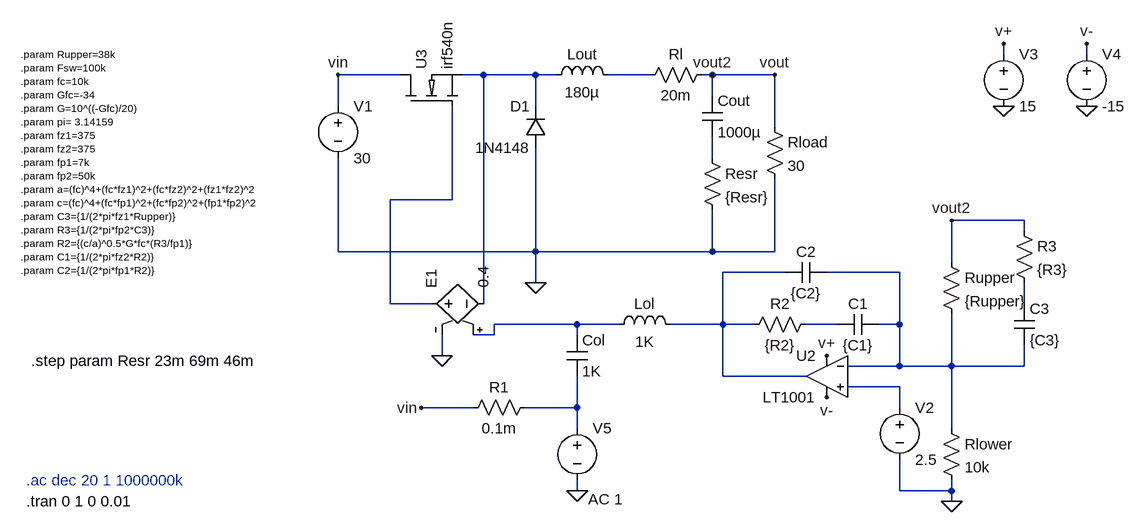
[diagram p0: schematic C P BASSO SMPS(BUCK) SIMULATION.asc]
C P BASSO SMPS(BUCK) SIMULATION.asc, the LTspice schematic file:
Version 4
SHEET 1 1188 756
WIRE 992 -48 992 -64
WIRE 1120 -48 1120 -64
WIRE 64 -16 -32 -16
WIRE 192 -16 160 -16
WIRE 272 -16 192 -16
WIRE 304 -16 272 -16
WIRE 448 -16 384 -16
WIRE 544 -16 528 -16
WIRE 640 -16 544 -16
WIRE 544 16 544 -16
WIRE -32 32 -32 -16
WIRE 272 32 272 -16
WIRE 640 64 640 -16
WIRE 544 112 544 80
WIRE 144 176 144 32
WIRE 144 176 48 176
WIRE 1024 208 912 208
WIRE 1024 224 1024 208
WIRE -32 256 -32 112
WIRE 272 256 272 96
WIRE 272 256 -32 256
WIRE 544 256 544 192
WIRE 544 256 272 256
WIRE 640 256 640 144
WIRE 640 256 544 256
WIRE 912 272 912 208
WIRE 656 288 560 288
WIRE 832 288 720 288
WIRE 272 304 272 256
WIRE 48 336 48 176
WIRE 112 336 48 336
WIRE 192 336 192 -16
WIRE 1024 336 1024 304
WIRE 336 368 208 368
WIRE 400 368 336 368
WIRE 560 368 560 288
WIRE 560 368 480 368
WIRE 608 368 560 368
WIRE 736 368 688 368
WIRE 832 368 832 288
WIRE 832 368 800 368
WIRE 208 384 208 368
WIRE 208 384 176 384
WIRE 336 384 336 368
WIRE 128 416 128 384
WIRE 832 432 832 368
WIRE 832 432 752 432
WIRE 912 432 912 352
WIRE 912 432 832 432
WIRE 1024 432 1024 400
WIRE 1024 432 912 432
WIRE 560 448 560 368
WIRE 688 448 560 448
WIRE 832 464 752 464
WIRE 176 496 96 496
WIRE 336 496 336 448
WIRE 336 496 256 496
WIRE 832 496 832 464
WIRE 336 528 336 496
WIRE 912 528 912 432
WIRE 336 624 336 608
WIRE 832 624 832 576
WIRE 912 624 912 608
WIRE 912 624 832 624
WIRE 912 640 912 624
FLAG 640 -16 vout
FLAG 912 208 vout2
FLAG 992 32 0
FLAG 1120 32 0
FLAG 992 -64 v+
FLAG 1120 -64 v-
FLAG 720 416 v+
FLAG 720 480 v-
FLAG 544 -16 vout2
FLAG -32 -16 vin
FLAG 336 624 0
FLAG 272 304 0
FLAG 912 640 0
FLAG 96 496 vin
FLAG 128 416 0
SYMBOL voltage -32 16 R0
WINDOW 123 0 0 Left 0
WINDOW 39 0 0 Left 0
SYMATTR InstName V1
SYMATTR Value 30
SYMBOL ind 288 0 R270
WINDOW 0 32 56 VTop 2
WINDOW 3 5 56 VBottom 2
SYMATTR InstName Lout
SYMATTR Value 180µ
SYMBOL res 544 -32 R90
WINDOW 0 0 56 VBottom 2
WINDOW 3 32 56 VTop 2
SYMATTR InstName Rl
SYMATTR Value 20m
SYMBOL cap 528 16 R0
SYMATTR InstName Cout
SYMATTR Value 1000µ
SYMBOL res 528 96 R0
SYMATTR InstName Resr
SYMATTR Value {Resr}
SYMBOL res 624 48 R0
SYMATTR InstName Rload
SYMATTR Value 30
SYMBOL OpAmps\\LT1001 720 384 M0
SYMATTR InstName U2
SYMBOL diode 288 96 R180
WINDOW 0 24 64 Left 2
WINDOW 3 24 0 Left 2
SYMATTR InstName D1
SYMATTR Value 1N4148
SYMBOL res 896 256 R0
SYMATTR InstName Rupper
SYMATTR Value {Rupper}
SYMBOL res 896 512 R0
SYMATTR InstName Rlower
SYMATTR Value 10k
SYMBOL voltage 832 480 R0
SYMATTR InstName V2
SYMATTR Value 2.5
SYMBOL res 1008 208 R0
SYMATTR InstName R3
SYMATTR Value {R3}
SYMBOL cap 1008 336 R0
SYMATTR InstName C3
SYMATTR Value {C3}
SYMBOL voltage 992 -64 R0
WINDOW 123 0 0 Left 0
WINDOW 39 0 0 Left 0
SYMATTR InstName V3
SYMATTR Value 15
SYMBOL voltage 1120 -64 R0
WINDOW 123 0 0 Left 0
WINDOW 39 0 0 Left 0
SYMATTR InstName V4
SYMATTR Value -15
SYMBOL res 704 352 R90
WINDOW 0 0 56 VBottom 2
WINDOW 3 32 56 VTop 2
SYMATTR InstName R2
SYMATTR Value {R2}
SYMBOL cap 800 352 R90
WINDOW 0 0 32 VBottom 2
WINDOW 3 32 32 VTop 2
SYMATTR InstName C1
SYMATTR Value {C1}
SYMBOL cap 720 272 R90
WINDOW 0 0 32 VBottom 2
WINDOW 3 32 32 VTop 2
SYMATTR InstName C2
SYMATTR Value {C2}
SYMBOL ind 384 384 R270
WINDOW 0 32 56 VTop 2
WINDOW 3 5 56 VBottom 2
SYMATTR InstName Lol
SYMATTR Value 1K
SYMBOL voltage 336 512 R0
WINDOW 3 17 97 Left 2
WINDOW 123 17 125 Left 2
WINDOW 39 0 0 Left 0
SYMATTR Value ""
SYMATTR Value2 AC 1
SYMATTR InstName V5
SYMBOL cap 320 384 R0
SYMATTR InstName Col
SYMATTR Value 1K
SYMBOL res 272 480 R90
WINDOW 0 0 56 VBottom 2
WINDOW 3 32 56 VTop 2
SYMATTR InstName R1
SYMATTR Value 0.1m
SYMBOL e2 96 336 R270
SYMATTR InstName E1
SYMATTR Value 0.4
SYMBOL irf540n 64 32 R270
SYMATTR InstName U3
TEXT -520 -48 Left 1 !.param Rupper=38k \n.param Fsw=100k\n.param fc=10k \n.param Gfc=-34\n.param G=10^((-Gfc)/20)\n.param pi= 3.14159\n.param fz1=375\n.param fz2=375\n.param fp1=7k\n.param fp2=50k\n.param a=(fc)^4+(fc*fz1)^2+(fc*fz2)^2+(fz1*fz2)^2\n.param c=(fc)^4+(fc*fp1)^2+(fc*fp2)^2+(fp1*fp2)^2\n.param C3={1/(2*pi*fz1*Rupper)}\n.param R3={1/(2*pi*fp2*C3)}\n.param R2={(c/a)^0.5*G*fc*(R3/fp1)}\n.param C1={1/(2*pi*fz2*R2)}\n.param C2={1/(2*pi*fp1*R2)}
TEXT -512 608 Left 2 ;.ac dec 20 1 1000000k
TEXT -504 424 Left 2 !.step param Resr 23m 69m 46m
TEXT -512 640 Left 2 !.tran 0 1 0 0.01

The netlist it stands for:
* C P BASSO SMPS(BUCK) SIMULATION.asc
V1 vin 0 30
Lout N001 N002 180µ
Rl vout2 N002 20m
Cout vout2 N003 1000µ
Resr N003 0 {Resr}
Rload vout2 0 30
XU2 N010 N006 v+ v- N005 LT1001  ; pins In+ In- V+ V- OUT
D1 0 N001 1N4148
Rupper vout2 N006 {Rupper}
Rlower N006 0 10k
V2 N010 0 2.5
R3 vout2 N007 {R3}
C3 N007 N006 {C3}
V3 v+ 0 15
V4 v- 0 -15
R2 N009 N005 {R2}
C1 N006 N009 {C1}
C2 N006 N005 {C2}
Lol N008 N005 1K
V5 N011 0 AC 1
Col N008 N011 1K
R1 N011 vin 0.1m
E1 N004 N001 N008 0 0.4
XU3 vin N004 N001 irf540n  ; pins D G S
.model D D
.lib standard.dio
.param Rupper=38k
.param Fsw=100k
.param fc=10k
.param Gfc=-34
.param G=10^((-Gfc)/20)
.param pi= 3.14159
.param fz1=375
.param fz2=375
.param fp1=7k
.param fp2=50k
.param a=(fc)^4+(fc*fz1)^2+(fc*fz2)^2+(fz1*fz2)^2
.param c=(fc)^4+(fc*fp1)^2+(fc*fp2)^2+(fp1*fp2)^2
.param C3={1/(2*pi*fz1*Rupper)}
.param R3={1/(2*pi*fp2*C3)}
.param R2={(c/a)^0.5*G*fc*(R3/fp1)}
.param C1={1/(2*pi*fz2*R2)}
.param C2={1/(2*pi*fp1*R2)}
* .ac dec 20 1 1000000k
.step param Resr 23m 69m 46m
.tran 0 1 0 0.01
.lib LTC.lib
.lib C:\Users\sudib\OneDrive\Documents\LTspiceXVII\irf540n.spi
.backanno
.end